# Altium schematic sheet dmx_duino.SchDoc
size A2
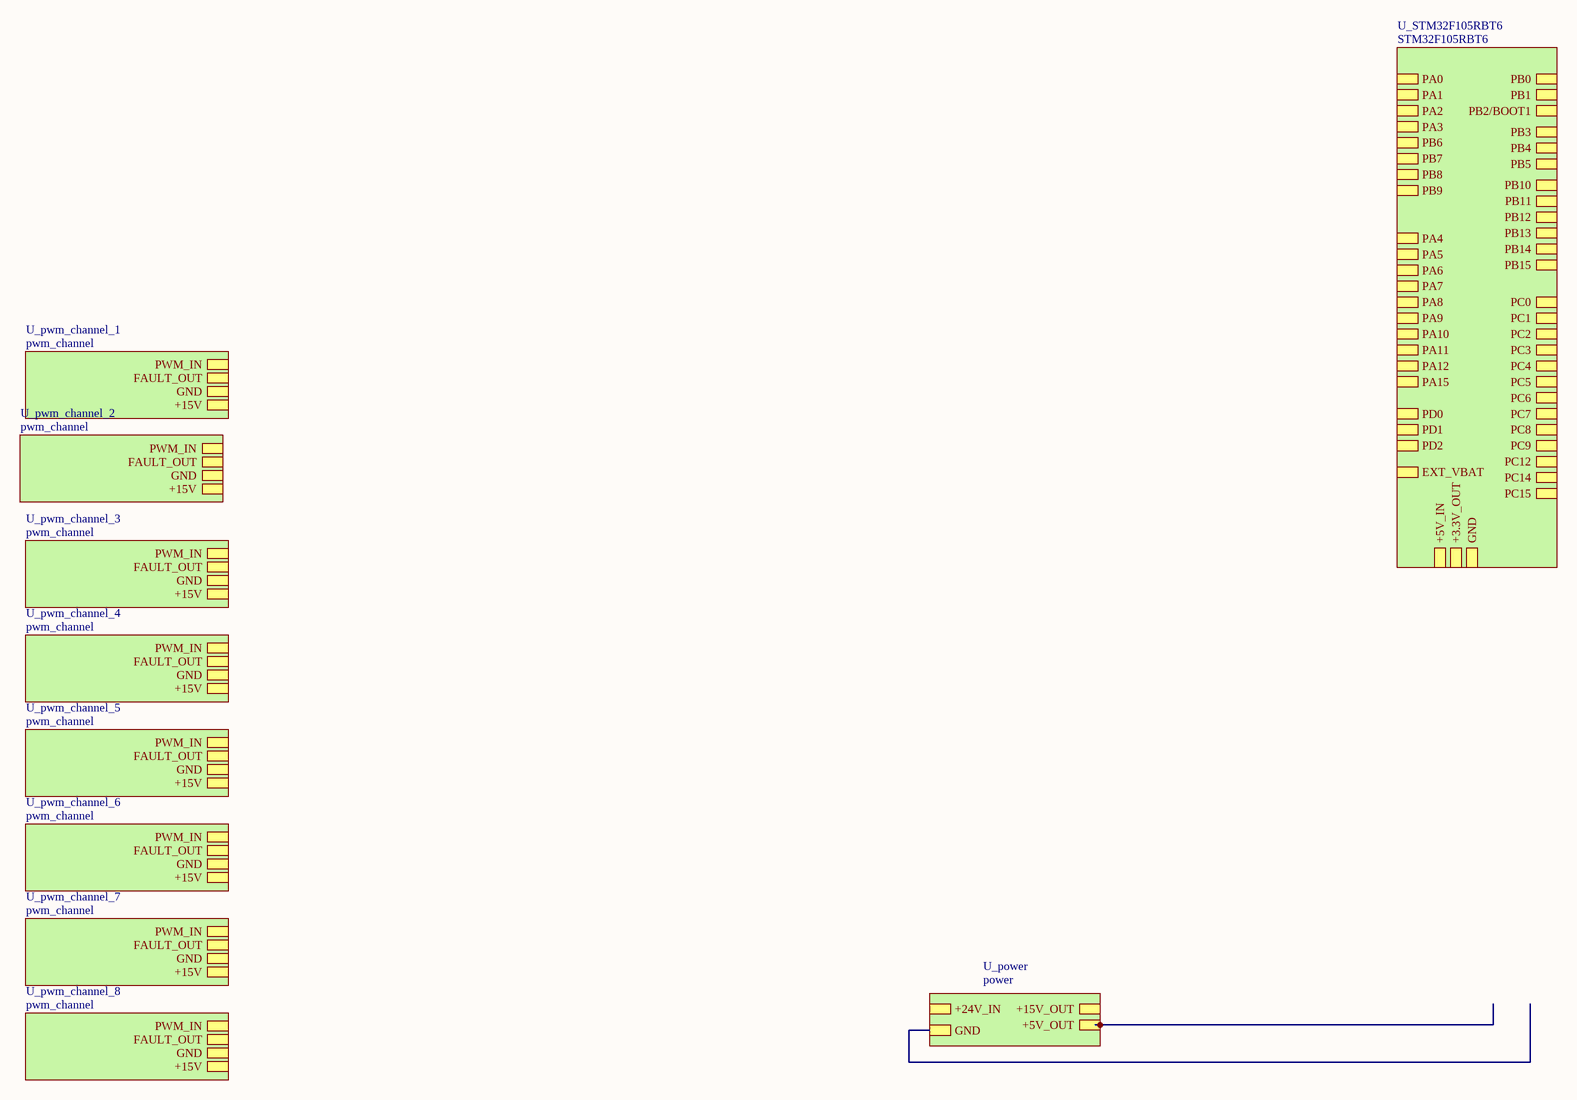
[diagram p0: dmx_duino.SchDoc]

## Sub-sheets
U_power = power: +15V_OUT, +5V_OUT, GND, +24V_IN
U_pwm_channel_1 = pwm_channel: PWM_IN, FAULT_OUT, GND, +15V
U_pwm_channel_2 = pwm_channel: PWM_IN, FAULT_OUT, GND, +15V
U_pwm_channel_3 = pwm_channel: PWM_IN, FAULT_OUT, GND, +15V
U_pwm_channel_4 = pwm_channel: PWM_IN, FAULT_OUT, GND, +15V
U_pwm_channel_5 = pwm_channel: PWM_IN, FAULT_OUT, GND, +15V
U_pwm_channel_6 = pwm_channel: PWM_IN, FAULT_OUT, GND, +15V
U_pwm_channel_7 = pwm_channel: PWM_IN, FAULT_OUT, GND, +15V
U_pwm_channel_8 = pwm_channel: PWM_IN, FAULT_OUT, GND, +15V
U_STM32F105RBT6 = STM32F105RBT6: PC15, PC14, PD0, PD1, PB2/BOOT1, EXT_VBAT, PB3, PB4, PB5, PB6, PB7, PB8, PB9, PB10, PB11, PB12, PB13, PB14, PB15, PC0, PC1, PC2, PC3, PC4, PC5, PC6, PC7, PC8, PC9, PC12, PD2, PB1, PB0, PA0, PA1, PA2, PA3, PA4, PA5, PA6, PA7, PA8, PA9, PA10, PA11, PA12, PA15, +5V_IN, +3.3V_OUT, GND